# EAGLE schematic counter-test (EAGLE 6.4)
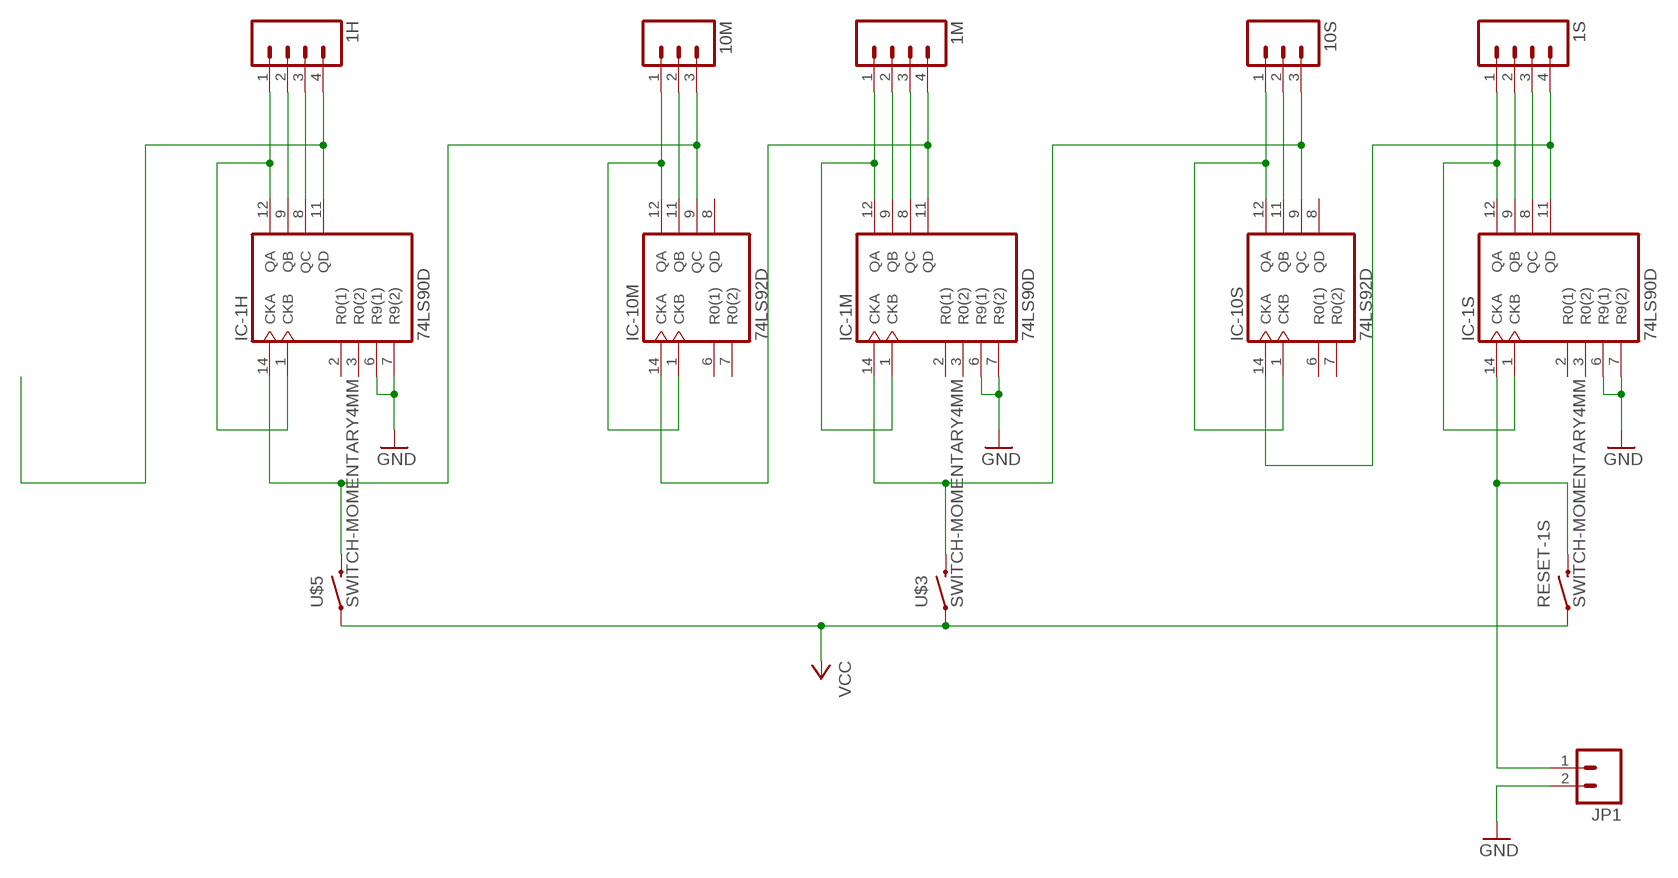
[diagram p0: schematic, sheet 1]

## Parts
1H  M04PTH  [1X04]
1M  M04PTH  [1X04]
1S  M04PTH  [1X04]
10M  M03PTH  [1X03]
10S  M03PTH  [1X03]
IC-1H  74LS90D  [SO14]
IC-1M  74LS90D  [SO14]
IC-1S  74LS90D  [SO14]
IC-10M  74LS92D  [SO14]
IC-10S  74LS92D  [SO14]
JP1  M02PTH  [1X02]
RESET-1S  SWITCH-MOMENTARY4MM  [TACTILE_SWITCH_SMD]
U$3  SWITCH-MOMENTARY4MM  [TACTILE_SWITCH_SMD]
U$5  SWITCH-MOMENTARY4MM  [TACTILE_SWITCH_SMD]

## Nets
GND: IC-1H.6(R9(1)) IC-1H.7(R9(2)) IC-1M.6(R9(1)) IC-1M.7(R9(2)) IC-1S.6(R9(1)) IC-1S.7(R9(2)) JP1.2
N$1: 1S.4 IC-1S.11(QD) IC-10S.14(CKA)
N$2: 1S.3 IC-1S.8(QC)
N$3: 1S.2 IC-1S.9(QB)
N$4: 1S.1 IC-1S.1(CKB) IC-1S.12(QA)
N$5: 10S.1 IC-10S.1(CKB) IC-10S.12(QA)
N$6: 10S.2 IC-10S.11(QB)
N$7: 10S.3 IC-1M.14(CKA) IC-10S.9(QC) U$3.3 U$3.4
N$8: 1M.4 IC-1M.11(QD) IC-10M.14(CKA)
N$9: 1M.3 IC-1M.8(QC)
N$10: 1M.2 IC-1M.9(QB)
N$11: 1M.1 IC-1M.1(CKB) IC-1M.12(QA)
N$12: 10M.1 IC-10M.1(CKB) IC-10M.12(QA)
N$13: 10M.2 IC-10M.11(QB)
N$14: 10M.3 IC-1H.14(CKA) IC-10M.9(QC) U$5.3 U$5.4
N$15: 1H.4 IC-1H.11(QD)
N$16: 1H.3 IC-1H.8(QC)
N$17: 1H.2 IC-1H.9(QB)
N$18: 1H.1 IC-1H.1(CKB) IC-1H.12(QA)
N$19: IC-1S.14(CKA) JP1.1 RESET-1S.3 RESET-1S.4
VCC: RESET-1S.1 RESET-1S.2 U$3.1 U$3.2 U$5.1 U$5.2
Unconnected: IC-1H.2(R0(1)) IC-1H.3(R0(2)) IC-1M.2(R0(1)) IC-1M.3(R0(2)) IC-1S.2(R0(1)) IC-1S.3(R0(2)) IC-10M.6(R0(1)) IC-10M.7(R0(2)) IC-10M.8(QD) IC-10S.6(R0(1)) IC-10S.7(R0(2)) IC-10S.8(QD)

## Power pins joined to a net without a drawn wire
GND: IC-1H.10(GND) IC-1M.10(GND) IC-1S.10(GND) IC-10M.10(GND) IC-10S.10(GND)
VCC: IC-1H.5(VCC) IC-1M.5(VCC) IC-1S.5(VCC) IC-10M.5(VCC) IC-10S.5(VCC)

## Library data of the parts
1H 1M 1S = iStivi - Header-Connector:M04: Header 4 Standard 4-pin 0.1" header. Use with straight break away headers (SKU : PRT-00116), right angle break away headers (PRT-00553), swiss pins (PRT-00743), machine pins (PRT-00117), and female headers (PRT-00115). Molex polarized connector foot print use with SKU : PRT-08231 with associated crimp pins and housings. 1MM SMD Version SKU: PRT-10208
10M 10S = iStivi - Header-Connector:M03: Header 3 Standard 3-pin 0.1" header. Use with straight break away headers (SKU : PRT-00116), right angle break away headers (PRT-00553), swiss pins (PRT-00743), machine pins (PRT-00117), and female headers (PRT-00115). Molex polarized connector foot print use with SKU : PRT-08232 with associated crimp pins and housings.
IC-1H IC-1M IC-1S = iStivi - ICs:74*90: Decade Counter BCD decade counter
IC-10M IC-10S = iStivi - ICs:74*92: Divide by 12 counter
JP1 = iStivi - Header-Connector:M02: Header 2 Standard 2-pin 0.1" header. Use with straight break away headers (SKU : PRT-00116), right angle break away headers (PRT-00553), swiss pins (PRT-00743), machine pins (PRT-00117), and female headers (PRT-00115). Molex polarized connector foot print use with SKU : PRT-08233 with associated crimp pins and housings.
RESET-1S U$3 U$5 = iStivi - Button-Switch:SWITCH-MOMENTARY: Momentary Switch